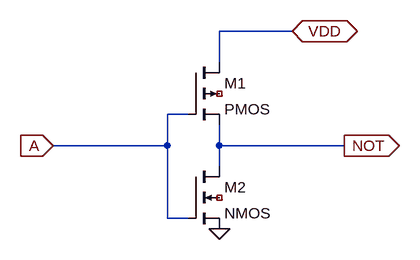
[diagram p0: schematic NOT_VDD.asc]
NOT_VDD.asc, the LTspice schematic file:
Version 4
SHEET 1 880 680
WIRE 272 0 160 0
WIRE 160 48 160 0
WIRE 112 128 80 128
WIRE 80 176 80 128
WIRE 80 176 -96 176
WIRE 160 176 160 144
WIRE 352 176 160 176
WIRE 160 208 160 176
WIRE 80 288 80 176
WIRE 112 288 80 288
FLAG 160 304 0
FLAG -96 176 A
IOPIN -96 176 In
FLAG 352 176 NOT
IOPIN 352 176 Out
FLAG 272 0 VDD
IOPIN 272 0 BiDir
SYMBOL pmos4 112 48 R0
SYMATTR InstName M1
SYMBOL nmos4 112 208 R0
SYMATTR InstName M2

The netlist it stands for:
* NOT_VDD.asc
M1 VDD A NOT NC_01 PMOS
M2 NOT A 0 NC_02 NMOS
.model NMOS NMOS
.model PMOS PMOS
.lib standard.mos
.backanno
.end